# Altium project Reflow.PrjPcb
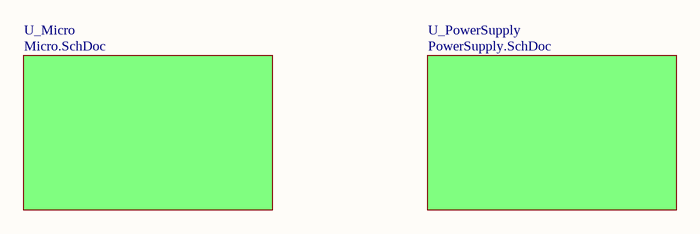
[diagram p0: Reflow.SchDoc]
4 sheets, 44 parts. Net scope: flat (ports and power ports of the same name join across sheets).
Board file: Reflow.PcbDoc
Sheets:
  Reflow.SchDoc
    U_Micro = Micro.SchDoc
      U_Thermocouple = Thermocouple.SchDoc
    U_PowerSupply = PowerSupply.SchDoc

## Sheet Reflow.SchDoc
size A4

### Sub-sheets
U_Micro = Micro.SchDoc: no entries
U_PowerSupply = PowerSupply.SchDoc: no entries

## Sheet Micro.SchDoc
size Letter
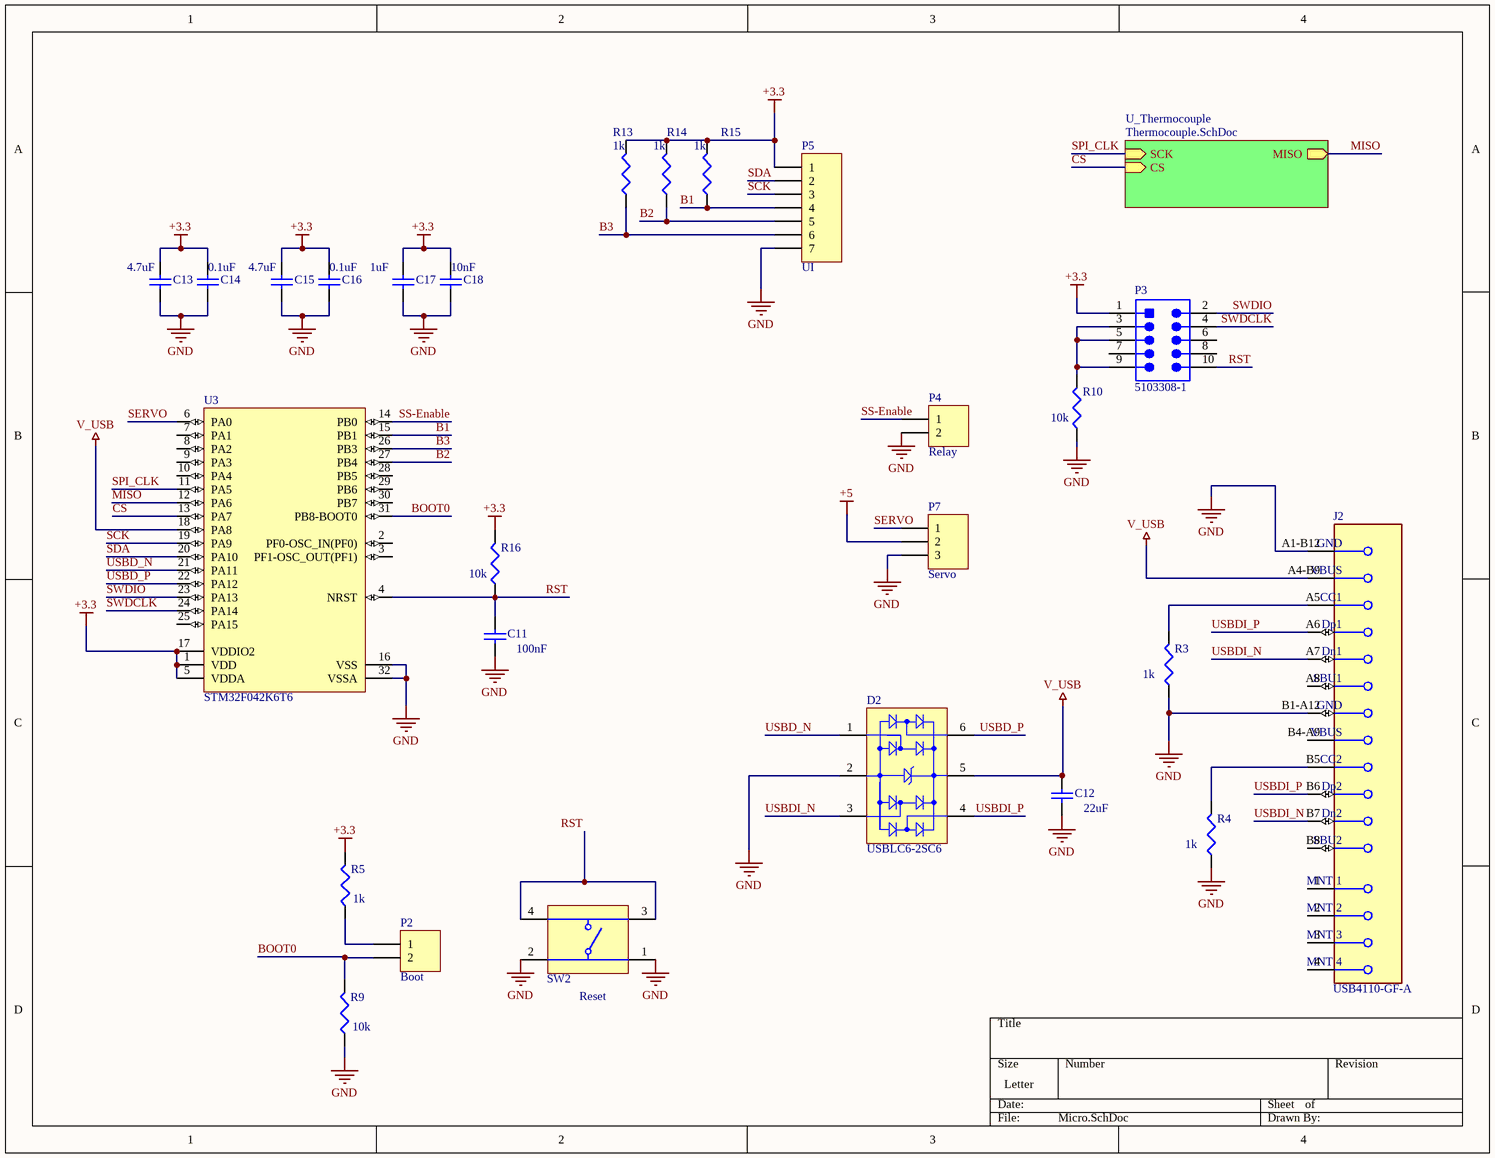
[diagram p1: Micro.SchDoc]

### Parts
C11  value 100nF  [1608[0603]]  (hidden comment: Cap Semi)
C12  value 22uF  [1608[0603]]  (hidden comment: Cap Semi)
C13  value 4.7uF  [1608[0603]]  (hidden comment: Cap Semi)
C14  value 0.1uF  [1608[0603]]  (hidden comment: Cap Semi)
C15  value 4.7uF  [1608[0603]]  (hidden comment: Cap Semi)
C16  value 0.1uF  [1608[0603]]  (hidden comment: Cap Semi)
C17  value 1uF  [1608[0603]]  (hidden comment: Cap Semi)
C18  value 10nF  [1608[0603]]  (hidden comment: Cap Semi)
D2  USBLC6-2SC6  [STM-SOT23-6L_V]
J2  USB4110-GF-A  [FP-USB4110-GF-A-MFG]
P2  Boot  [HDR1X2]
P3  5103308-1  [TECO-5103308-1_V]
P4  Relay  [HDR1X2H]
P5  UI  [HDR1X7H]
P7  Servo  [HDR1X3H]
R3  value 1k  [J1-0603]  (hidden comment: Res3)
R4  value 1k  [J1-0603]  (hidden comment: Res3)
R5  value 1k  [J1-0603]  (hidden comment: Res3)
R9  value 10k  [J1-0603]  (hidden comment: Res3)
R10  value 10k  [J1-0603]  (hidden comment: Res3)
R13  value 1k  [J1-0603]  (hidden comment: Res3)
R14  value 1k  [J1-0603]  (hidden comment: Res3)
R15  value 1k  [J1-0603]  (hidden comment: Res3)
R16  value 10k  [J1-0603]  (hidden comment: Res3)
SW2  Reset  [CKCP-PTS525SM10SMTR-4_V]
U3  STM32F042K6T6  [STM-LQFP32_M]

### Sub-sheets
U_Thermocouple = Thermocouple.SchDoc: SCK (in), MISO (out), CS (in)

### Nets
+3.3: C13.2 C14.2 C15.2 C16.2 C17.2 C18.2 P3.1 P5.1 R5.2 R13.2 R14.2 R15.2 R16.2 U3.1(VDD) U3.5(VDDA) U3.17(VDDIO2)
+5: P7.2
GND: C11.1 C12.1 C13.1 C14.1 C15.1 C16.1 C17.1 C18.1 D2.2(GND) J2.A1-B12(GND) J2.B1-A12(GND) P4.2 P5.7 P7.3 R3.1 R4.1 R9.1 R10.1 SW2.1 SW2.2 U3.16(VSS) U3.32(VSSA)
V_USB: C12.2 D2.5(VBUS) J2.A4-B9(VBUS) U3.18(PA8)
B1: P5.4 R15.1 U3.15(PB1)
B2: P5.5 R14.1 U3.27(PB4)
B3: P5.6 R13.1 U3.26(PB3)
BOOT0: P2.2 R9.2 U3.31(PB8-BOOT0)
CS: U3.13(PA7) ; sheet U_Thermocouple/CS
MISO: U3.12(PA6) ; sheet U_Thermocouple/MISO
RST: C11.2 P3.10 R16.1 SW2.3 SW2.4 U3.4(NRST)
SCK: P5.3 U3.19(PA9)
SDA: P5.2 U3.20(PA10)
SERVO: P7.1 U3.6(PA0)
SPI_CLK: U3.11(PA5) ; sheet U_Thermocouple/SCK
SS-Enable: P4.1 U3.14(PB0)
SWDCLK: P3.4 U3.24(PA14)
SWDIO: P3.2 U3.23(PA13)
USBD_N: D2.1(I/O_1) U3.21(PA11)
USBD_P: D2.6(I/O_4) U3.22(PA12)
USBDI_N: D2.3(I/O_2) J2.A7(Dn1) J2.B7(Dn2)
USBDI_P: D2.4(I/O_3) J2.A6(Dp1) J2.B6(Dp2)
NetJ2_A5: J2.A5(CC1) R3.2
NetJ2_B5: J2.B5(CC2) R4.2
NetP2_1: P2.1 R5.1
NetP3_3: P3.3 P3.5 P3.9 R10.2

Not connected (* = marked no-connect by the designer): J2 1(MNT_1) 2(MNT_2) 3(MNT_3) 4(MNT_4) A8(SBU1) B4-A9(VBUS) B8(SBU2); P3 6 7 8; U3 2(PF0-OSC_IN(PF0)) 3(PF1-OSC_OUT(PF1)) 7(PA1) 8(PA2) 9(PA3) 10(PA4) 25(PA15) 28(PB5) 29(PB6) 30(PB7)

### Library data of the parts
C11 C12 = Cap Semi_3: Capacitor (Semiconductor SIM Model); Published: 8-Jun-2000; LatestRevisionDate: 29-May-2009; LatestRevisionNote: IPC-7351 Footprint Added.; PackageReference: C1206; Publisher: Altium Limited; PackageDescription: Chip Capacitor; LCSC Part #: C14663
C13 C15 C17 = Cap Semi_1: Capacitor (Semiconductor SIM Model); Published: 8-Jun-2000; LatestRevisionDate: 29-May-2009; LatestRevisionNote: IPC-7351 Footprint Added.; PackageReference: C1206; Publisher: Altium Limited; PackageDescription: Chip Capacitor; LCSC Part #: C15849
C14 C16 C18 = Cap Semi_2: Capacitor (Semiconductor SIM Model); Published: 8-Jun-2000; LatestRevisionDate: 29-May-2009; LatestRevisionNote: IPC-7351 Footprint Added.; PackageReference: C1206; Publisher: Altium Limited; PackageDescription: Chip Capacitor; LCSC Part #: C15195
D2 = CMP-2000-05378-1: Very low capacitance ESD protection, 3.5 pF, -40 to 125 degC, 6-Pin SOT23, RoHS, Tape and Reel; Manufacturer: STMicroelectronics; Polarity: Uni-Directional; Clamping Voltage: 17V; Rad Hardened: No; Product Height (mm): 1.3mm; Leakage Current (Max): 0.15uA; Product Length (mm): 3.05mm; Number of Elements: 1; Peak Pulse Current: 5A; Configuration: Dual; Reverse Breakdown Voltage: 6V; Working Voltage (Max): 5V; Capacitance Value: 3.5pF; Suppressor Type: DiodeArrays; Product Depth (mm): 1.75mm; Test Current (It): 1mA; Package / Case: SOT-23; Operating Temperature Max Deg. C: 125C; Package Description: 6-Pin Small Outline Transistor, Body 2.925 x 1.625 mm, Pitch 0.95 mm; Package Reference: SOT23-6L; Datasheet Version: Rev. 5, 10/2011; Operating Temperature Min Deg. C: -40C; Mounting Style: SurfaceMount; Direction Type: Uni-Directional; Mounting: SurfaceMount; Pin Count: 6; Leakage Current: 0.15uA; Packaging: TapeandReel; Operating Temperature Classification: Automotive; Clamping Voltage (Max): 17V; Manufacturer URL: http://www.st.com/; Reverse Stand-off Voltage: 5V; Datasheet URL: http://www.st.com/st-web-ui/static/active/en/resource/technical/document/datasheet/CD00050750.pdf; Working Voltage: 5V; Operating Temp Range: -40Cto125C
J2 = CMP-245163-000002-1: CONN USB 2.0 TYPE-C R/A SMT; Manufacturer: GCT; Conn Orientation: Right Angle; Usb Standard: USB 2.0; Voltage Rating: 20V; Current Rating: 3/4.25/1.25/0.25A; Number Of Contacts: 16; Is Female: yes; Shielding: true; Standoff Height: 0.1mm; Octopart: https://octopart.com/usb4110-gf-a-gct-103941985; Temperature: -40°C to +85°C; RoHS: TRUE; Automotive: No; Contact Material: Gold,Nickel; Device Class L1: Connectors; Device Class L2: USB Connectors; Package: 0; Lead Free: Yes; ComponentLink2URL: https://gct.co/files/drawings/usb4110.pdf; Temperature Range High: +85°C; Temperature Range Low: -40°C; Height: 3.46mm; Manufacturer Part Number: USB4110-GF-A; ComponentLink2Description: Datasheet; Device Class L3: unset; Digikey Description: CONN USB 2.0 TYPE-C R/A SMT; Category: Conn
P2 = Header 2: Header, 2-Pin; LatestRevisionDate: 17-Jul-2002; LatestRevisionNote: Re-released for DXP Platform.; Publisher: Altium Limited
P3 = CMP-2000-05416-1: Male Header, Pitch 2.54 mm, 2 x 5 Position, Height 9.85 mm, Tail Length 3.05 mm, RoHS, Tube; Manufacturer: TE Connectivity; Pitch: 0.100"(2.54mm); Mating Products: 1658624-1-ND / -CONNRCPT10POSPOLARGOLD / 1658527-4-ND / -CONNRCPT10POS.100W/STRRELF / 1658527-3-ND / -CONNRCPT10POS.100622SERIES / 1658526-3-ND / -CONNRCPT10POSVERTGOLD / 1658526-5-ND / -609-1041LFFEMSOCKT,LEADFREE / 1658526-4-ND / -609-1030LFFEMSOCKT,LEADFREE / ASC10B-ND / -CONNIDCSOCKET10POSGOLD / ASC10H-ND / -CONNIDCSOCKET10POS15GOLD / AKC10B-ND / -CONNIDCSKT10POSW/POLGOLD / AKC10H-ND / -CONNIDCSKT10POSW/POL15GOLD / More...; Dynamic Catalog: AMP-LatchSeries; Number of Positions Loaded: All; Featured Product: AMP-LATCHRibbonCableConnectors; 3D Model: 5103308-1.pdf; Number of Positions: 10; Other Names: A33159; Catalog Drawings: LowProfileShroudedStraight; Connector Type: Header,Shrouded; Termination: Solder; Contact Finish Thickness: 15µin(0.38µm); Datasheet URL: http://www.onlinecomponents.com/productFiles/mf-AMP/eng_cat_889409_0699_96_.pdf; Standard Package: 125; Number of Rows: 2; Contact Type: MalePin; Mounting Type: ThroughHole; Manufacturer URL: http://www.te.com/; Contact Finish: GoldorGold-Palladium; Family: RectangularConnectors-Headers,MalePins; RoHS Information: 5103308-1StatementofCompliance; Packaging: Tube; Category: Connectors,Interconnects; Datasheet Version: Apr-12; Contact Mating Length: 0.240"(6.10mm); Series: AMP-Latch; Row Spacing: 0.100"(2.54mm); Color: Black
P4 = Header 2H: Header, 2-Pin, Right Angle; LatestRevisionDate: 17-Jul-2002; LatestRevisionNote: Re-released for DXP Platform.; Publisher: Altium Limited
P5 = Header 7H: Header, 7-Pin, Right Angle; LatestRevisionDate: 17-Jul-2002; LatestRevisionNote: Re-released for DXP Platform.; Publisher: Altium Limited
P7 = Header 3H: Header, 3-Pin, Right Angle; LatestRevisionDate: 17-Jul-2002; LatestRevisionNote: Re-released for DXP Platform.; Publisher: Altium Limited
R3-R5 R9 R10 R13-R16 = Res3_2: Resistor; Published: 8-Jun-2000; LatestRevisionDate: 29-May-2009; LatestRevisionNote: IPC-7351 Footprint Added.; PackageReference: J1-0603; Publisher: Altium Limited; PackageDescription: Chip Resistor; LCSC Part #: C25804
SW2 = CMP-2000-05088-1: Microminiature Tact Switch, SPST-NO, 50 mA, 12 VDC, -40 to 60 degC, 4-Pin SMD, RoHS, Tape and Reel; Part No: PTS525SM10SMTRLFS; Manufacturer: C&K Components; Maximum DC Voltage Rating: 12V; Body Orientation: Straight; Dielectric Strength: 250VAC; Pole Throw Configuration: SPST; Operating Force: 1.57N; Minimum Insulation Resistance: 100000MOhm; Actuator Length: 0.3mm; Base Material: Nylon6/6,Glass/Polyester; Switch Configuration: N.O.; Contact Rating @ Voltage: 0.05@12VDCA; Ground Terminal: No; Mechanical Life: 100000Cycles; Actuator Style: RoundButton; Illumination Type: N/R; Maximum Contact Resistance: 100mOhm; Datasheet Version: Apr-09; Contact Material: PhosphorBronze; Dimension: 5.25x6.4x1.5mm; Family: PTS525; Type: N/A; Seal Description: N/A; Mounting: SurfaceMount,GullWing; Product Weight: N/A; Seal Location: N/A; Electrical Life: N/A; Manufacturer URL: http://www.ckswitches.com/; Datasheet URL: https://datasheet.ciiva.com/18145/getdatasheetpartid-226915-18145102.pdf; Maximum AC Voltage Rating: N/A; Supplier: C&KComponents; HTS: 8536501199; Contact Plating: SilverClad; Actuator Color: N/A; Operating Temperature: -40to60C; ECCN: EAR99; Supplier Standard Pack: 3,000; RoHS: Yes; Housing Material: N/A; Packaging: TapeandReel
U3 = CMP-0304-00114-2: ARM Cortex-M0 32-bit MCU, 32 KB Flash, 6 KB Internal RAM, 28 I/Os, 32-Pin LQFP, -40 to 85 degC, Tray; Manufacturer: STMicroelectronics; Operating Frequency(F) (Processor speed) (MHz): 48; Internal RAM Size (kB): 6; Supply Voltage(Vcc) min (V): 2; I/Os (High Current): 28; FLASH Size (Prog) (kB): 32; ComponentLink1Description: Manufacturer URL; Package Reference: LQFP32; ComponentLink2Description: Datasheet; ComponentLink1URL: http://www.st.com/; Core: ARM Cortex-M0; DatasheetVersion: Rev. 5; ComponentLink2URL: http://www.st.com/st-web-ui/static/active/en/resource/technical/document/datasheet/DM00105814.pdf; Packing: Tray; Package Description: 32-Pin Low Profile Quad Flat Package, 7 x 7 mm Body, 0.8 mm Pitch; PartNumber: STM32F042K6T6; Mounting Technology: Surface Mount

## Sheet Thermocouple.SchDoc
size Letter
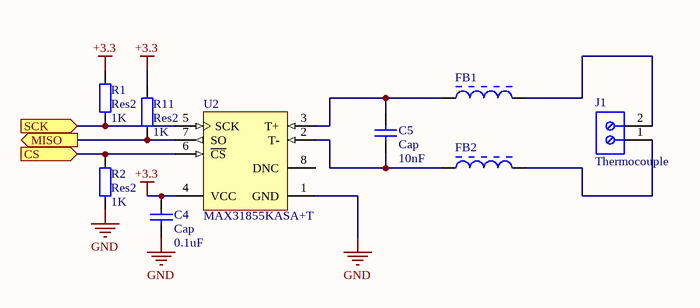
[diagram p2: Thermocouple.SchDoc]

### Parts
C4  Cap  value 0.1uF  [1608[0603]]
C5  Cap  value 10nF  [1608[0603]]
FB1  BLM21AG102SN1D  [6-0805_M]  (value not drawn)
FB2  BLM21AG102SN1D  [6-0805_M]  (value not drawn)
J1  Thermocouple  [691137710002]
R1  Res2  value 1K  [J1-0603]
R2  Res2  value 1K  [J1-0603]
R11  Res2  value 1K  [J1-0603]
U2  MAX31855KASA+T  [MAXM-S8+4_N]

### Ports
CS (in), MISO (out), SCK (in)

### Nets
+3.3: C4.2 R1.2 R11.2 U2.4(VCC)
GND: C4.1 R2.1 U2.1(GND)
NetC5_1: C5.1 FB2.1 U2.2(T-)
NetC5_2: C5.2 FB1.1 U2.3(T+)
NetFB1_2: FB1.2 J1.2
NetFB2_2: FB2.2 J1.1
NetR1_1: R1.1 U2.5(SCK) ; port SCK
NetR2_2: R2.2 U2.6(~{CS}) ; port CS
NetR11_1: R11.1 U2.7(SO) ; port MISO

Not connected (* = marked no-connect by the designer): U2 8(DNC)

### Library data of the parts
C4 C5 = Cap: Capacitor; Published: 8-Jun-2000; LatestRevisionDate: 17-Jul-2002; LatestRevisionNote: Re-released for DXP Platform.; PackageReference: RAD-0.3; Publisher: Altium Limited; PackageDescription: Radial Cap, Thru-Hole; 2 Leads; 0.3 in Pin Spacing
FB1 FB2 = MURA-FB-2: Chip Ferrite Bead for General Signal lines, 1000 Ohm, 500 mA, -55 to 125 degC, 2 x 1.25 x 1.05 mm SMD, Tape and Reel; Manufacturer: Murata; Impedance (at 100 MHz): 1000 Ohm +/- 25%; DC Resistance: 0.28 Ohm Max.; Rated Current: 500 mA; ComponentLink1Description: Manufacturer URL; PackageDescription: 2-Pin Chip, Body 2 x 1.25 mm; DatasheetVersion: 08/2013; PartNumber: BLM21AG102SN1D; Mounting Technology: Surface Mount; Operating Temperature Range: -55 to 125 degC; ComponentLink2URL: http://www.murata.com/products/catalog/pdf/c31e.pdf; ComponentLink3Description: Package Specification; ComponentLink2Description: Datasheet; Packing: Tape and Reel; ComponentLink3URL: http://www.murata.com/products/catalog/pdf/c31e.pdf; ComponentLink1URL: http://www.murata.com/; PackageReference: BLM21_H1050-2; LCSC Part #: C1015
J1 = CMP-1502-03324-1: Series 1377 - 5.00 mm Horizontal Entry with Pressure Clamp WR-TBL, 2 pin; Manufacturer: Wurth Elektronik; Pin Number: 2; Pitch: 5.00mm; Operating Temperature: -30to120degC; Package Reference: 691137710002; Publisher: WurthElektronik; Mounting Technology: THT; Manufacturer URL: http://www.we-online.de; Packaging: Box; Part Number: 691137710002; Datasheet URL: http://katalog.we-online.de/pbs/datasheet/691137710002.pdf
R1 R2 R11 = Res2: Resistor; Published: 8-Jun-2000; LatestRevisionDate: 17-Jul-2002; LatestRevisionNote: Re-released for DXP Platform.; PackageReference: AXIAL-0.4; Publisher: Altium Limited; PackageDescription: Axial Device, Thru-Hole; 2 Leads; 0.4 in Pin Spacing
U2 = CMP-0253-00398-1: Cold Junction Compensated Thermocouple to Digital Converter, 14 Bits Temperature Resolution, -40 to 125 degC, 8-Pin SOIC (S8+4), Pb-Free, Tape ang Reel; Interface: SPI; Parasite Pwr.: No; Functions: Thermocouple-to-Digital Converter; ComponentLink3Description: Package Specification; DatasheetVersion: Rev. 2; Generic Part Number: MAX31855; PartNumber: MAX31855KASA+T; PackageReference: S8+4; ComponentLink3URL: http://pdfserv.maximintegrated.com/package_dwgs/21-0041.PDF; Code_JEDEC: MS-012; Packing: Tape ang Reel; PackageDescription: 8-Pin Small-Outline IC, Narrow, Body 3.9 x 4.9 mm, Pitch 1.27 mm; Mounting Technology: Surface Mount; ComponentLink1URL: http://www.maximintegrated.com/; PackageVersion: Rev. D, 10/2012; ComponentLink2URL: http://datasheets.maximintegrated.com/en/ds/MAX31855.pdf; ComponentLink1Description: Manufacturer URL; ComponentLink2Description: Datasheet

## Sheet PowerSupply.SchDoc
size Letter
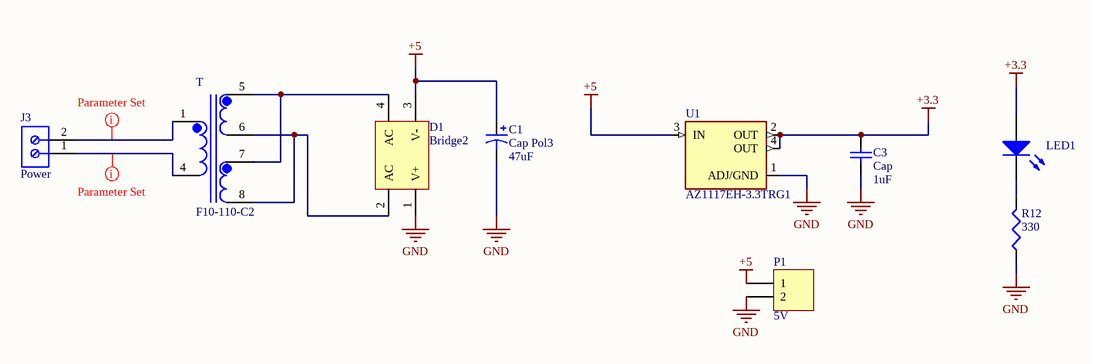
[diagram p3: PowerSupply.SchDoc]

### Parts
C1  Cap Pol3  value 47uF  [2.5mmCap]
C3  Cap  value 1uF  [1608[0603]]
D1  Bridge2  [SOP250P700X300-4N]
J3  Power  [691137710002]
LED1  150120BS75000  [1206_A]  (value not drawn)
P1  5V  [HDR1X2H]
R12  value 330  [1608[0603]]  (hidden comment: Res3)
T  F10-110-C2  [XFMR_F10-110]
U1  AZ1117EH-3.3TRG1  [SOT230P700X180-4N]

### Nets
+3.3: C3.2 LED1.2(A) U1.2(OUT) U1.4(OUT)
+5: C1.1 D1.3(V-) P1.1 U1.3(IN)
GND: C1.2 C3.1 D1.1(V+) P1.2 R12.1 U1.1(ADJ/GND)
NetD1_2: D1.2(AC) T.6 T.8
NetD1_4: D1.4(AC) T.5 T.7
NetJ3_1: J3.1 T.4
NetJ3_2: J3.2 T.1
NetLED1_1: LED1.1(K) R12.2

### Layout directives
rule Width Constraint [Pref Width = 2mm    Min Width = 2mm    Max Width = 2mm]: NetJ3_1, NetJ3_2

### Library data of the parts
C1 = Cap Pol3: Polarized Capacitor (Surface Mount); Published: 8-Jun-2000; LatestRevisionDate: 29-May-2009; LatestRevisionNote: IPC-7351 Footprint Added.; PackageReference: C0805; Publisher: Altium Limited; PackageDescription: Chip Capacitor
C3 = Cap: Capacitor; Published: 8-Jun-2000; LatestRevisionDate: 17-Jul-2002; LatestRevisionNote: Re-released for DXP Platform.; PackageReference: RAD-0.3; Publisher: Altium Limited; PackageDescription: Radial Cap, Thru-Hole; 2 Leads; 0.3 in Pin Spacing
D1 = Bridge2: Diode Bridge; pin to pad: 1>2 2>3 3>1; Published: 24-Mar-1999; LatestRevisionDate: 17-Jul-2002; LatestRevisionNote: Re-released for DXP Platform.; PackageReference: D-46_6A; Publisher: Altium Limited; PackageDescription: Bridge Rectifier; 4 Terminals; Body 16.8 x 16.8 mm (typ); Pitch 10.67 mm
J3 = CMP-1502-03324-1: as J1 on sheet Thermocouple; Operating Temperature: -30to120degC; Package Reference: 691137710002; Publisher: WurthElektronik; Mounting Technology: THT; Manufacturer URL: http://www.we-online.de; Packaging: Box; Part Number: 691137710002; Datasheet URL: http://katalog.we-online.de/pbs/datasheet/691137710002.pdf
LED1 = CMP-1426-00015-1: SMD mono-color Chip LED, WL-SMCW, Blue; Manufacturer: Wuerth Elektronik; ComponentLink2Description: Datasheet; ComponentLink1URL: http://www.we-online.com; PartNumber: 150120BS75000; ComponentLink1Description: Manufacturer URL; ComponentLink2URL: http://katalog.we-online.com/led/datasheet/150120BS75000.pdf; PackageReference: 1206_A; Color: Blue
P1 = Header 2H: Header, 2-Pin, Right Angle; LatestRevisionDate: 17-Jul-2002; LatestRevisionNote: Re-released for DXP Platform.; Publisher: Altium Limited
R12 = Res3_2: Resistor; Published: 8-Jun-2000; LatestRevisionDate: 29-May-2009; LatestRevisionNote: IPC-7351 Footprint Added.; PackageReference: J1-0603; Publisher: Altium Limited; PackageDescription: Chip Resistor; LCSC Part #: C25804
T = F10-110-C2: F10 Series Single Primary Dual Secondary Split Bobbin Class 2 Transformer; MF: Triad Magnetics; Digi-Key_Part_Number: 237-1557-ND; Package: Triad Magnetics; Value: *; SnapEDA_Link: https://www.snapeda.com/parts/F10-110-C2/Triad%20Magnetics/view-part/2768214/?ref=snap; Digi-Key_Purchase_URL: https://www.digikey.in/product-detail/en/triad-magnetics/F10-110-C2/237-1557-ND/3986429?utm_source=snapeda&utm_medium=aggregator&utm_campaign=symbol; MP: F10-110-C2
U1 = AZ1117EH-3.3TRG1: Linear Voltage Regulator IC 1 Output 1A SOT-223; MF: Diodes Inc.; Package: SOT-223 Diodes Inc.; Value: *; Price: None; MP: AZ1117EH-3.3TRG1; SnapEDA_Link: https://www.snapeda.com/parts/AZ1117EH-3.3TRG1/Diodes%20Inc./view-part/482930/?ref=snap; Availability: Unavailable

## Nets that join several sheets
+3.3: Micro (16 pins), Thermocouple (C4.2 R1.2 R11.2 U2.4), PowerSupply (C3.2 LED1.2 U1.2 U1.4)
+5: Micro (P7.2), PowerSupply (C1.1 D1.3 P1.1 U1.3)
GND: Micro (22 pins), Thermocouple (C4.1 R2.1 U2.1), PowerSupply (6 pins)